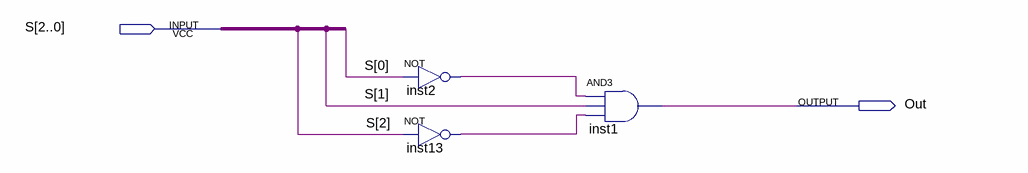
[diagram p0: schematic sheet]
// Quartus schematic twos_complement_detector.bdf as structural Verilog: 3 symbols, 2 pins
module twos_complement_detector (
  input  [2:0] S,
  output Out
);

  wire inst2_out, inst13_out;

  not inst2 (inst2_out, S[0]);
  not inst13 (inst13_out, S[2]);
  and inst1 (Out, inst2_out, S[1], inst13_out);
endmodule
